# Altium schematic sheet LDO.SchDoc
size 209 x 297 mm; DocumentCode: Децимальный номер; SchemeType: Схема электрическая принципиальная; PageSetup: Record=PageOptionsZCenterHorizontal=TrueZCenterVertical=TrueZPrintScale=0.95ZXCorrection=1.00ZYCorrection=1.00ZPrintKind=2ZBorderSize=5000000ZLeftOffset=0ZBottomOffset=0ZOrientation=1ZPaperLength=1000ZPaperWidth=1000ZScale=100ZPaperSource=7ZPrintQuality=600ZMediaType=1ZDitherType=10ZPaperKind=A4 (210 x 297 мм)ZPrintScaleMode=1
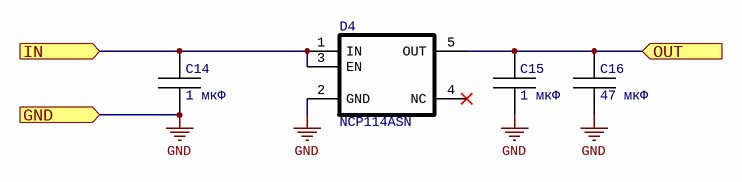
[diagram p0: LDO.SchDoc]

## Parts
C14  value 1 мкФ  [STD-0402]  (hidden comment: cap)
C15  value 1 мкФ  [STD-0402]  (hidden comment: cap)
C16  value 47 мкФ  [STD-0805]  (hidden comment: cap)
D4  NCP114ASN  [SOT-23-5]

## Ports
GND (in), IN (in), OUT (in)

## Nets
GND: C14.1 C15.1 C16.1 D4.2(GND) ; port GND
IN: C14.2 D4.1(IN) D4.3(EN) ; port IN
OUT: C15.2 C16.2 D4.5(OUT) ; port OUT

Not connected (* = marked no-connect by the designer): D4 4(NC)*

## Notes on the sheet
- Перв. примен.
- Справ. №
- Подп. и дата
- Инв. № дубл.
- Взам. инв. №
- Изм.
- Лист
- № докум.
- Подп.
- Дата
- Инв. № подл.
- Копировал
- Формат А4

## Library data of the parts
C14 C15 = C0402-1u-16v-10%-X7R: Конденсатор; Part Number: C0402-1u-16v-10%-X7R
C16 = C0805-47u-6.3v-20%-X5R: Конденсатор; Part Number: C0805-47u-6.3v-20%-X5R
D4 = NCP114ASN330T1G: LDO; Part Number: NCP114ASN330T1G